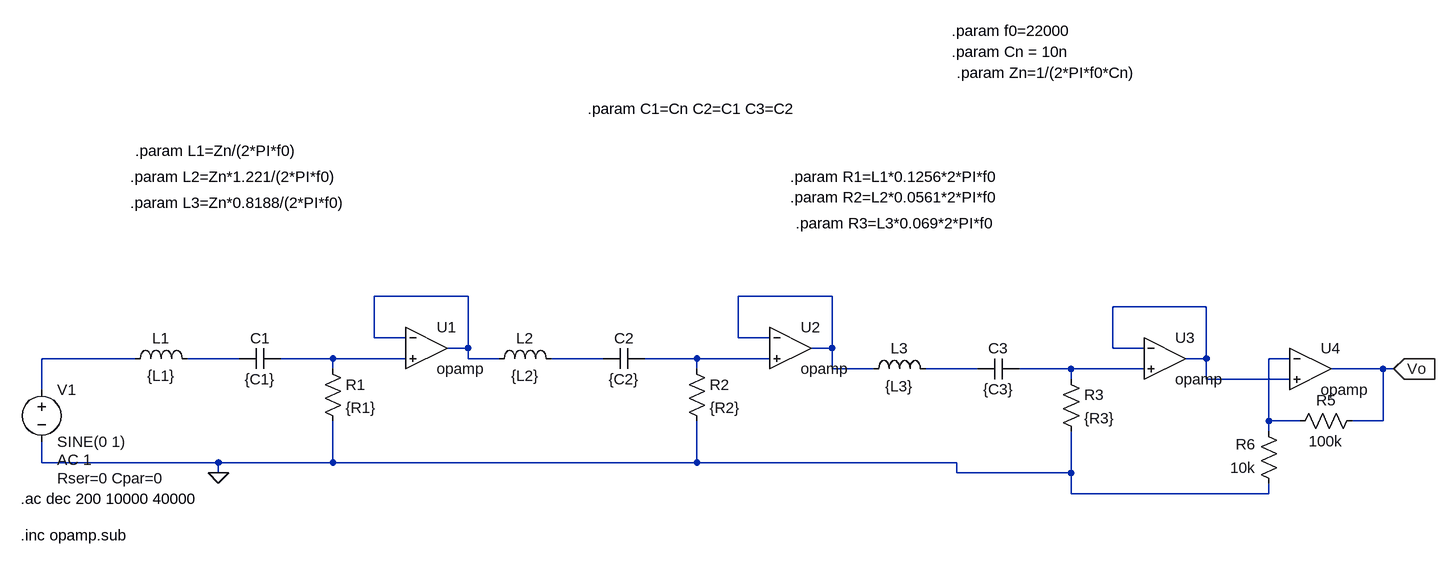
[diagram p0: schematic BPF_pasivo_1.asc]
BPF_pasivo_1.asc, the LTspice schematic file:
Version 4
SHEET 1 1640 680
WIRE 80 96 -64 96
WIRE 640 96 496 96
WIRE 1216 112 1072 112
WIRE -64 160 -64 96
WIRE -16 160 -64 160
WIRE 496 160 496 96
WIRE 544 160 496 160
WIRE 80 176 80 96
WIRE 80 176 48 176
WIRE 640 176 640 96
WIRE 640 176 608 176
WIRE 1072 176 1072 112
WIRE 1120 176 1072 176
WIRE -432 192 -576 192
WIRE -272 192 -352 192
WIRE -128 192 -208 192
WIRE -16 192 -128 192
WIRE 80 192 80 176
WIRE 128 192 80 192
WIRE 288 192 208 192
WIRE 432 192 352 192
WIRE 544 192 432 192
WIRE 1216 192 1216 112
WIRE 1216 192 1184 192
WIRE 1344 192 1312 192
WIRE -128 208 -128 192
WIRE 432 208 432 192
WIRE 640 208 640 176
WIRE 704 208 640 208
WIRE 864 208 784 208
WIRE 1008 208 928 208
WIRE 1120 208 1008 208
WIRE 1488 208 1408 208
WIRE 1504 208 1488 208
WIRE 1008 224 1008 208
WIRE 1216 224 1216 192
WIRE 1344 224 1216 224
WIRE -576 240 -576 192
WIRE 1312 288 1312 192
WIRE 1360 288 1312 288
WIRE 1488 288 1488 208
WIRE 1488 288 1440 288
WIRE 1312 304 1312 288
WIRE -576 352 -576 320
WIRE -304 352 -576 352
WIRE -128 352 -128 288
WIRE -128 352 -304 352
WIRE 432 352 432 288
WIRE 432 352 -128 352
WIRE 832 352 432 352
WIRE -304 368 -304 352
WIRE 832 368 832 352
WIRE 1008 368 1008 304
WIRE 1008 368 832 368
WIRE 1008 400 1008 368
WIRE 1312 400 1312 384
WIRE 1312 400 1008 400
FLAG -304 368 0
FLAG 1504 208 Vo
IOPIN 1504 208 In
SYMBOL ind -448 208 R270
WINDOW 0 32 56 VTop 2
WINDOW 3 5 56 VBottom 2
SYMATTR InstName L1
SYMATTR Value {L1}
SYMBOL cap -208 176 R90
WINDOW 0 0 32 VBottom 2
WINDOW 3 32 32 VTop 2
SYMATTR InstName C1
SYMATTR Value {C1}
SYMBOL res -144 192 R0
SYMATTR InstName R1
SYMATTR Value {R1}
SYMBOL voltage -576 224 R0
WINDOW 123 24 124 Left 2
WINDOW 39 24 152 Left 2
SYMATTR Value2 AC 1
SYMATTR SpiceLine Rser=0 Cpar=0
SYMATTR InstName V1
SYMATTR Value SINE(0 1)
SYMBOL ind 112 208 R270
WINDOW 0 32 56 VTop 2
WINDOW 3 5 56 VBottom 2
SYMATTR InstName L2
SYMATTR Value {L2}
SYMBOL cap 352 176 R90
WINDOW 0 0 32 VBottom 2
WINDOW 3 32 32 VTop 2
SYMATTR InstName C2
SYMATTR Value {C2}
SYMBOL res 416 192 R0
SYMATTR InstName R2
SYMATTR Value {R2}
SYMBOL ind 688 224 R270
WINDOW 0 32 56 VTop 2
WINDOW 3 5 56 VBottom 2
SYMATTR InstName L3
SYMATTR Value {L3}
SYMBOL cap 928 192 R90
WINDOW 0 0 32 VBottom 2
WINDOW 3 32 32 VTop 2
SYMATTR InstName C3
SYMATTR Value {C3}
SYMBOL res 992 208 R0
SYMATTR InstName R3
SYMATTR Value {R3}
SYMBOL OpAmps\\opamp 16 112 R0
SYMATTR InstName U1
SYMBOL OpAmps\\opamp 576 112 R0
SYMATTR InstName U2
SYMBOL OpAmps\\opamp 1152 128 R0
SYMATTR InstName U3
SYMBOL OpAmps\\opamp 1376 144 R0
SYMATTR InstName U4
SYMBOL res 1456 272 R90
WINDOW 0 0 56 VBottom 2
WINDOW 3 32 56 VTop 2
SYMATTR InstName R5
SYMATTR Value 100k
SYMBOL res 1328 400 R180
WINDOW 0 36 76 Left 2
WINDOW 3 36 40 Left 2
SYMATTR InstName R6
SYMATTR Value 10k
TEXT 264 -192 Left 2 !.param C1=Cn C2=C1 C3=C2
TEXT -432 -128 Left 2 !.param L1=Zn/(2*PI*f0)
TEXT -440 -88 Left 2 !.param L2=Zn*1.221/(2*PI*f0)
TEXT -440 -48 Left 2 !.param L3=Zn*0.8188/(2*PI*f0)
TEXT 576 -88 Left 2 !.param R1=L1*0.1256*2*PI*f0
TEXT 576 -56 Left 2 !.param R2=L2*0.0561*2*PI*f0
TEXT 584 -16 Left 2 !.param R3=L3*0.069*2*PI*f0
TEXT -608 408 Left 2 !.ac dec 200 10000 40000
TEXT -608 464 Left 2 !.inc opamp.sub
TEXT 824 -280 Left 2 !.param Cn = 10n
TEXT 832 -248 Left 2 !.param Zn=1/(2*PI*f0*Cn)
TEXT 824 -312 Left 2 !.param f0=22000

The netlist it stands for:
* BPF_pasivo_1.asc
L1 N004 N005 {L1}
C1 N006 N005 {C1}
R1 N006 0 {R1}
V1 N004 0 SINE(0 1) AC 1 Rser=0 Cpar=0
L2 N001 N007 {L2}
C2 N008 N007 {C2}
R2 N008 0 {R2}
L3 N002 N010 {L3}
C3 N011 N010 {C3}
R3 N011 0 {R3}
XU1 N001 N006 N001 opamp Aol=100K GBW=10Meg  ; pins invin noninvin out
XU2 N002 N008 N002 opamp Aol=100K GBW=10Meg  ; pins invin noninvin out
XU3 N003 N011 N003 opamp Aol=100K GBW=10Meg  ; pins invin noninvin out
XU4 N009 N003 Vo opamp Aol=100K GBW=10Meg  ; pins invin noninvin out
R5 Vo N009 100k
R6 0 N009 10k
.param C1=Cn C2=C1 C3=C2
.param L1=Zn/(2*PI*f0)
.param L2=Zn*1.221/(2*PI*f0)
.param L3=Zn*0.8188/(2*PI*f0)
.param R1=L1*0.1256*2*PI*f0
.param R2=L2*0.0561*2*PI*f0
.param R3=L3*0.069*2*PI*f0
.ac dec 200 10000 40000
.inc opamp.sub
.param Cn = 10n
.param Zn=1/(2*PI*f0*Cn)
.param f0=22000
.backanno
.end

* Results of the author's LTspice run, read from the files saved beside the schematic
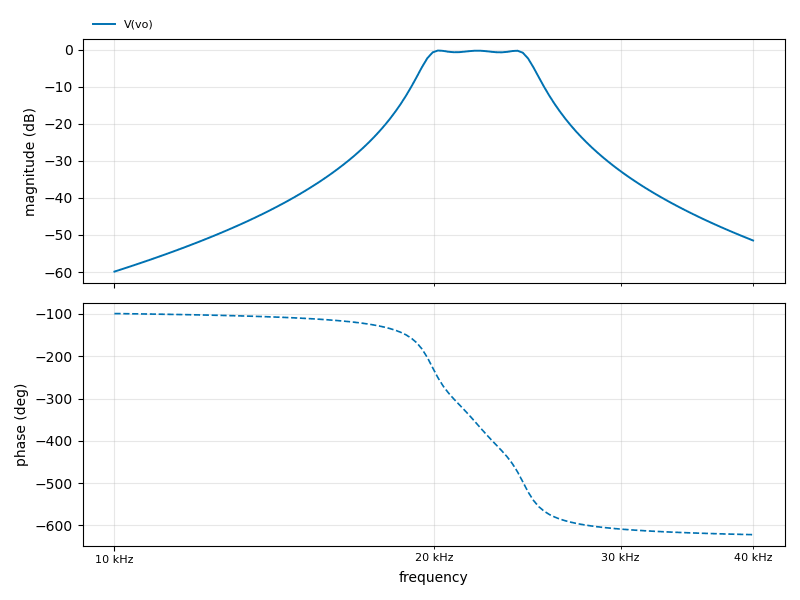
[diagram p1: AC Analysis of BPF_pasivo_1.asc, plotted from the saved traces]
* AC Analysis, 1 run:
*   V(vo): -59.87 dB at 10 kHz, -51.48 dB at 40 kHz, peak -0.23 dB at 20.18 kHz, 3 dB below the peak at 19.63 kHz and 24.65 kHz